# EAGLE design eib-128 (EAGLE 8.3.2)
DESIGNER: JON NEWMAN; DESIGN_NAME: EIB-128; LICENSE: CERN OHL v1.2; REVISION: 1.1
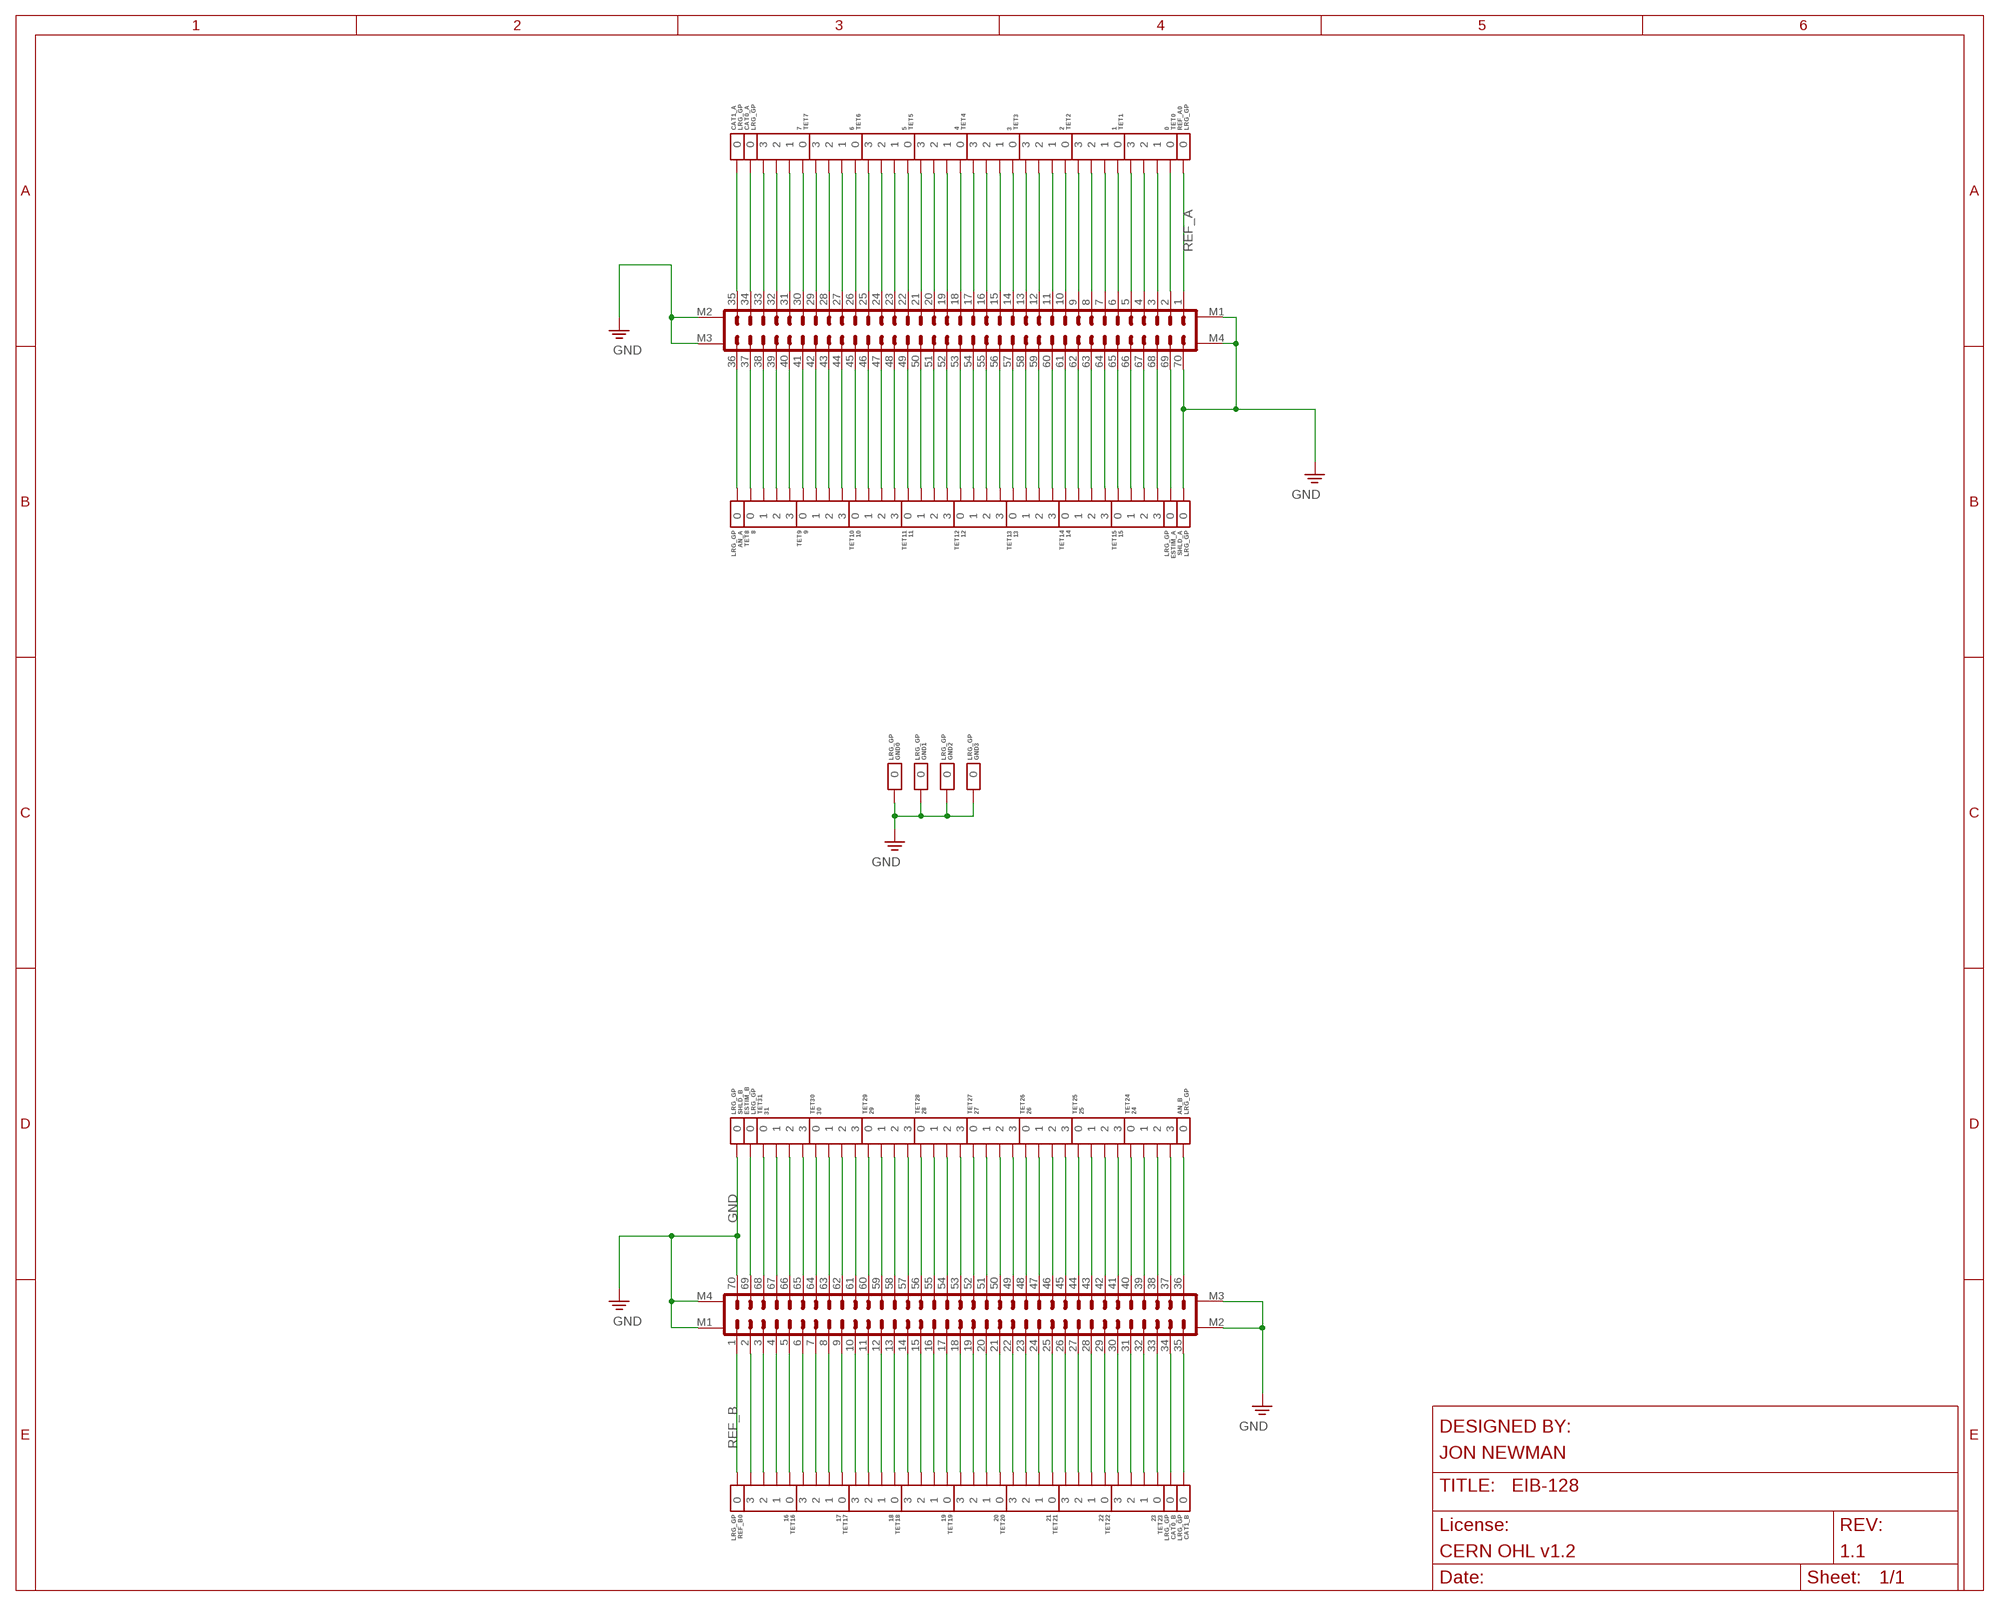
[diagram p0: schematic, sheet 1]

## Parts
A  DF40HEAD  PINHD-2X35+4_DF40-70HEAD  [DF40-70HEAD]
AN_A  LRG_GP  GOLDPIN_0.5ID_0.7OD  [GOLDPIN_0.5ID_0.7OD]
AN_B  LRG_GP  GOLDPIN_0.5ID_0.7OD  [GOLDPIN_0.5ID_0.7OD]
B  DF40HEAD  PINHD-2X35+4_DF40-70HEAD  [DF40-70HEAD]
CAT0_A  LRG_GP  GOLDPIN_0.5ID_0.7OD  [GOLDPIN_0.5ID_0.7OD]
CAT0_B  LRG_GP  GOLDPIN_0.5ID_0.7OD  [GOLDPIN_0.5ID_0.7OD]
CAT1_A  LRG_GP  GOLDPIN_0.5ID_0.7OD  [GOLDPIN_0.5ID_0.7OD]
CAT1_B  LRG_GP  GOLDPIN_0.5ID_0.7OD  [GOLDPIN_0.5ID_0.7OD]
ESTIM_A  LRG_GP  GOLDPIN_0.5ID_0.7OD  [GOLDPIN_0.5ID_0.7OD]
ESTIM_B  LRG_GP  GOLDPIN_0.5ID_0.7OD  [GOLDPIN_0.5ID_0.7OD]
GND0  LRG_GP  GOLDPIN_0.5ID_0.7OD  [GOLDPIN_0.5ID_0.7OD]
GND1  LRG_GP  GOLDPIN_0.5ID_0.7OD  [GOLDPIN_0.5ID_0.7OD]
GND2  LRG_GP  GOLDPIN_0.5ID_0.7OD  [GOLDPIN_0.5ID_0.7OD]
GND3  LRG_GP  GOLDPIN_0.5ID_0.7OD  [GOLDPIN_0.5ID_0.7OD]
REF_A0  LRG_GP  GOLDPIN_0.5ID_0.7OD  [GOLDPIN_0.5ID_0.7OD]
REF_B0  LRG_GP  GOLDPIN_0.5ID_0.7OD  [GOLDPIN_0.5ID_0.7OD]
SHLD_A  LRG_GP  GOLDPIN_0.5ID_0.7OD  [GOLDPIN_0.5ID_0.7OD]
SHLD_B  LRG_GP  GOLDPIN_0.5ID_0.7OD  [GOLDPIN_0.5ID_0.7OD]
TET0  0  TETRODE_128_0.5ID_0.7OD  [TETRODE_128_0.5ID_0.7OD]
TET1  1  TETRODE_128_0.5ID_0.7OD  [TETRODE_128_0.5ID_0.7OD]
TET2  2  TETRODE_128_0.5ID_0.7OD  [TETRODE_128_0.5ID_0.7OD]
TET3  3  TETRODE_128_0.5ID_0.7OD  [TETRODE_128_0.5ID_0.7OD]
TET4  4  TETRODE_128_0.5ID_0.7OD  [TETRODE_128_0.5ID_0.7OD]
TET5  5  TETRODE_128_0.5ID_0.7OD  [TETRODE_128_0.5ID_0.7OD]
TET6  6  TETRODE_128_0.5ID_0.7OD  [TETRODE_128_0.5ID_0.7OD]
TET7  7  TETRODE_128_0.5ID_0.7OD  [TETRODE_128_0.5ID_0.7OD]
TET8  8  TETRODE_128_0.5ID_0.7OD  [TETRODE_128_0.5ID_0.7OD]
TET9  9  TETRODE_128_0.5ID_0.7OD  [TETRODE_128_0.5ID_0.7OD]
TET10  10  TETRODE_128_0.5ID_0.7OD  [TETRODE_128_0.5ID_0.7OD]
TET11  11  TETRODE_128_0.5ID_0.7OD  [TETRODE_128_0.5ID_0.7OD]
TET12  12  TETRODE_128_0.5ID_0.7OD  [TETRODE_128_0.5ID_0.7OD]
TET13  13  TETRODE_128_0.5ID_0.7OD  [TETRODE_128_0.5ID_0.7OD]
TET14  14  TETRODE_128_0.5ID_0.7OD  [TETRODE_128_0.5ID_0.7OD]
TET15  15  TETRODE_128_0.5ID_0.7OD  [TETRODE_128_0.5ID_0.7OD]
TET16  16  TETRODE_128_0.5ID_0.7OD  [TETRODE_128_0.5ID_0.7OD]
TET17  17  TETRODE_128_0.5ID_0.7OD  [TETRODE_128_0.5ID_0.7OD]
TET18  18  TETRODE_128_0.5ID_0.7OD  [TETRODE_128_0.5ID_0.7OD]
TET19  19  TETRODE_128_0.5ID_0.7OD  [TETRODE_128_0.5ID_0.7OD]
TET20  20  TETRODE_128_0.5ID_0.7OD  [TETRODE_128_0.5ID_0.7OD]
TET21  21  TETRODE_128_0.5ID_0.7OD  [TETRODE_128_0.5ID_0.7OD]
TET22  22  TETRODE_128_0.5ID_0.7OD  [TETRODE_128_0.5ID_0.7OD]
TET23  23  TETRODE_128_0.5ID_0.7OD  [TETRODE_128_0.5ID_0.7OD]
TET24  24  TETRODE_128_0.5ID_0.7OD  [TETRODE_128_0.5ID_0.7OD]
TET25  25  TETRODE_128_0.5ID_0.7OD  [TETRODE_128_0.5ID_0.7OD]
TET26  26  TETRODE_128_0.5ID_0.7OD  [TETRODE_128_0.5ID_0.7OD]
TET27  27  TETRODE_128_0.5ID_0.7OD  [TETRODE_128_0.5ID_0.7OD]
TET28  28  TETRODE_128_0.5ID_0.7OD  [TETRODE_128_0.5ID_0.7OD]
TET29  29  TETRODE_128_0.5ID_0.7OD  [TETRODE_128_0.5ID_0.7OD]
TET30  30  TETRODE_128_0.5ID_0.7OD  [TETRODE_128_0.5ID_0.7OD]
TET31  31  TETRODE_128_0.5ID_0.7OD  [TETRODE_128_0.5ID_0.7OD]

## Nets
AN_A: A.36 AN_A.P$1
AN_B: AN_B.P$1 B.36
CAT0_A: A.34 CAT0_A.P$1
CAT0_B: B.34 CAT0_B.P$1
CAT1_A: A.35 CAT1_A.P$1
CAT1_B: B.35 CAT1_B.P$1
ESTIM_A: A.69 ESTIM_A.P$1
ESTIM_B: B.69 ESTIM_B.P$1
GND: A.70 A.M1 A.M2 A.M3 A.M4 B.70 B.M1 B.M2 B.M3 B.M4 GND0.P$1 GND1.P$1 GND2.P$1 GND3.P$1 SHLD_A.P$1 SHLD_B.P$1
N$65: B.33 TET23.0
N$66: B.32 TET23.1
N$67: B.31 TET23.2
N$68: B.30 TET23.3
N$69: B.29 TET22.0
N$70: B.28 TET22.1
N$71: B.27 TET22.2
N$72: B.26 TET22.3
N$73: B.25 TET21.0
N$74: B.24 TET21.1
N$75: B.23 TET21.2
N$76: B.22 TET21.3
N$77: B.21 TET20.0
N$78: B.20 TET20.1
N$79: B.19 TET20.2
N$80: B.18 TET20.3
N$81: B.17 TET19.0
N$82: B.16 TET19.1
N$83: B.15 TET19.2
N$84: B.14 TET19.3
N$85: B.13 TET18.0
N$86: B.12 TET18.1
N$87: B.11 TET18.2
N$88: B.10 TET18.3
N$89: B.9 TET17.0
N$90: B.8 TET17.1
N$91: B.7 TET17.2
N$92: B.6 TET17.3
N$93: B.5 TET16.0
N$94: B.4 TET16.1
N$95: B.3 TET16.2
N$96: B.38 TET24.2
N$97: B.39 TET24.1
N$98: B.40 TET24.0
N$99: B.41 TET25.3
N$100: B.42 TET25.2
N$101: B.43 TET25.1
N$102: B.44 TET25.0
N$103: B.45 TET26.3
N$104: B.46 TET26.2
N$105: B.47 TET26.1
N$106: B.48 TET26.0
N$107: B.49 TET27.3
N$108: B.50 TET27.2
N$109: B.51 TET27.1
N$110: B.52 TET27.0
N$111: B.53 TET28.3
N$112: B.54 TET28.2
N$113: B.55 TET28.1
N$114: B.56 TET28.0
N$115: B.57 TET29.3
N$116: B.58 TET29.2
N$117: B.59 TET29.1
N$118: B.60 TET29.0
N$119: B.61 TET30.3
N$120: B.62 TET30.2
N$121: B.63 TET30.1
N$122: B.64 TET30.0
N$123: B.65 TET31.3
N$124: B.66 TET31.2
N$125: B.67 TET31.1
N$126: B.68 TET31.0
N$127: B.2 TET16.3
N$128: B.37 TET24.3
N$199: A.33 TET7.3
N$200: A.32 TET7.2
N$201: A.31 TET7.1
N$202: A.30 TET7.0
N$203: A.29 TET6.3
N$204: A.28 TET6.2
N$205: A.27 TET6.1
N$206: A.26 TET6.0
N$207: A.25 TET5.3
N$208: A.24 TET5.2
N$209: A.23 TET5.1
N$210: A.22 TET5.0
N$211: A.21 TET4.3
N$212: A.20 TET4.2
N$213: A.19 TET4.1
N$214: A.18 TET4.0
N$215: A.17 TET3.3
N$216: A.16 TET3.2
N$217: A.15 TET3.1
N$218: A.14 TET3.0
N$219: A.13 TET2.3
N$220: A.12 TET2.2
N$221: A.11 TET2.1
N$222: A.10 TET2.0
N$223: A.9 TET1.3
N$224: A.8 TET1.2
N$225: A.7 TET1.1
N$226: A.6 TET1.0
N$227: A.5 TET0.3
N$228: A.4 TET0.2
N$229: A.3 TET0.1
N$230: A.2 TET0.0
N$231: A.38 TET8.1
N$232: A.39 TET8.2
N$233: A.40 TET8.3
N$234: A.41 TET9.0
N$235: A.42 TET9.1
N$236: A.43 TET9.2
N$237: A.44 TET9.3
N$238: A.45 TET10.0
N$239: A.46 TET10.1
N$240: A.47 TET10.2
N$241: A.48 TET10.3
N$242: A.49 TET11.0
N$243: A.50 TET11.1
N$244: A.51 TET11.2
N$245: A.52 TET11.3
N$246: A.53 TET12.0
N$247: A.54 TET12.1
N$248: A.55 TET12.2
N$249: A.56 TET12.3
N$250: A.57 TET13.0
N$251: A.58 TET13.1
N$252: A.59 TET13.2
N$253: A.60 TET13.3
N$254: A.61 TET14.0
N$255: A.62 TET14.1
N$256: A.63 TET14.2
N$257: A.64 TET14.3
N$258: A.65 TET15.0
N$259: A.66 TET15.1
N$260: A.67 TET15.2
N$261: A.68 TET15.3
N$1000: A.37 TET8.0
REF_A: A.1 REF_A0.P$1
REF_B: B.1 REF_B0.P$1

## Library data of the parts
A B = jonnew:PINHD-2X35+4
AN_A AN_B CAT0_A CAT0_B CAT1_A CAT1_B ESTIM_A ESTIM_B GND0 GND1-GND3 REF_A0 REF_B0 SHLD_A SHLD_B = jonnew:GOLDPIN
TET0 TET1-TET31 = jonnew:TETRODE

## Net classes
1 thick: width 0.102 mm

## Board
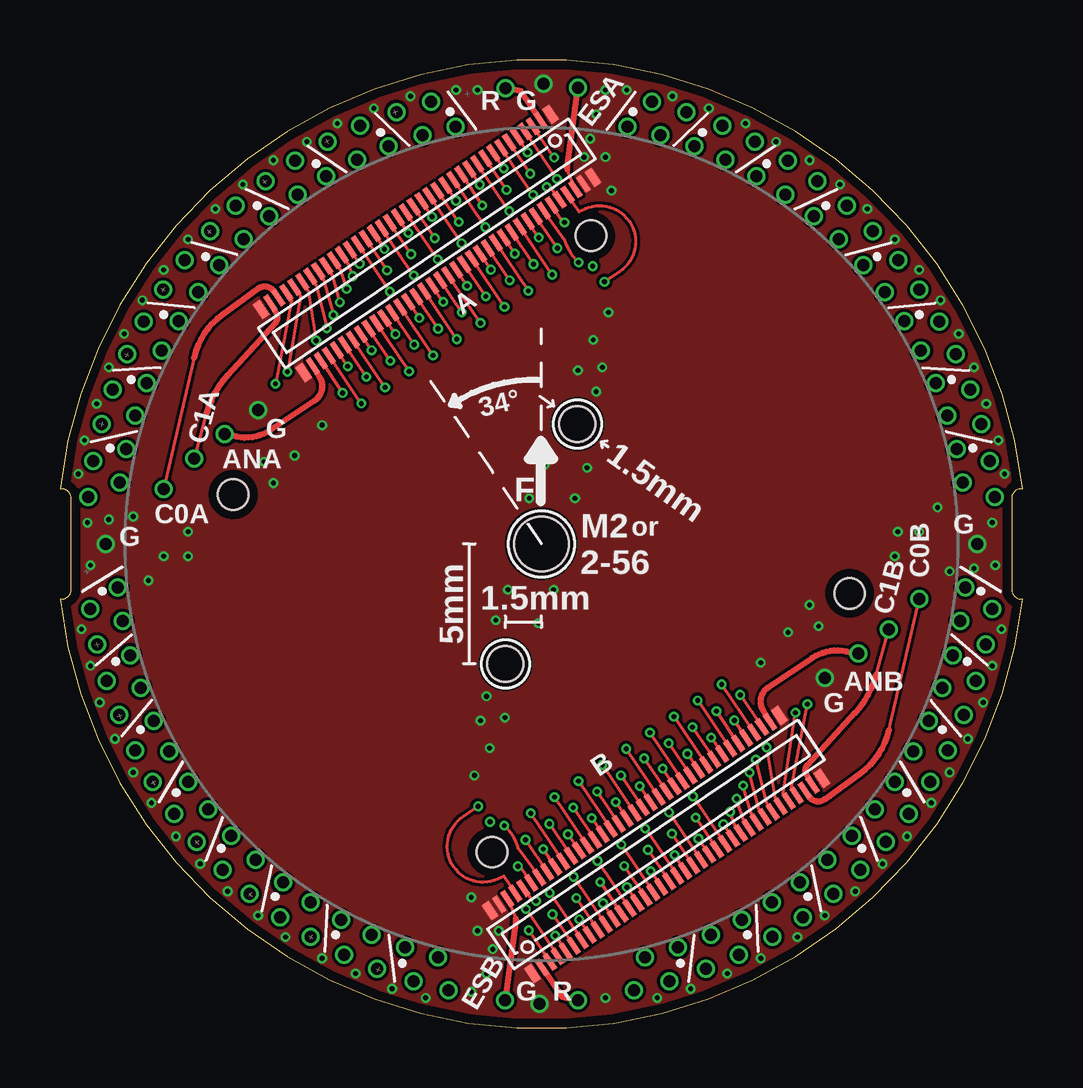
[diagram p1: board, top side]
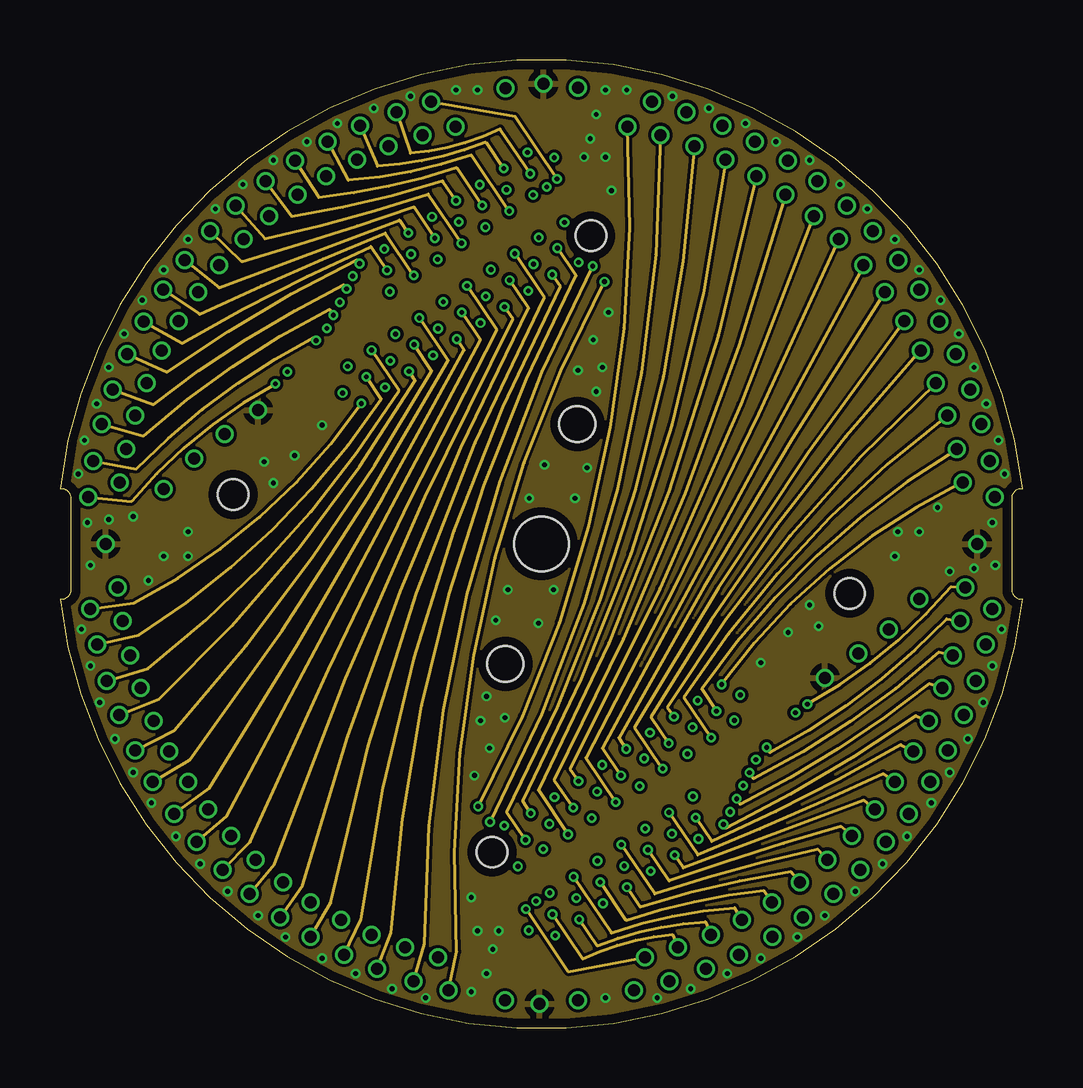
[diagram p2: board, inner layer Route2]
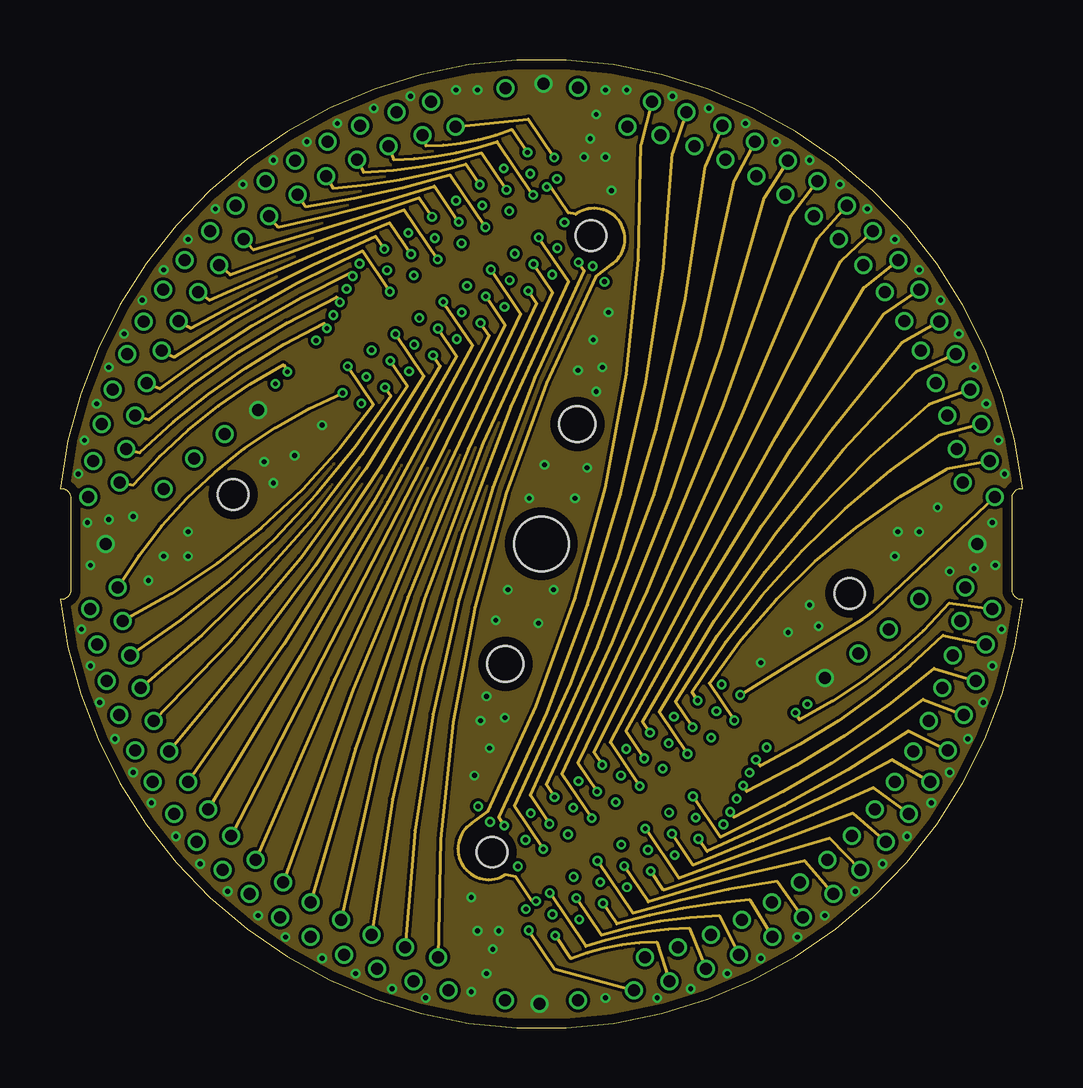
[diagram p3: board, inner layer Route15]
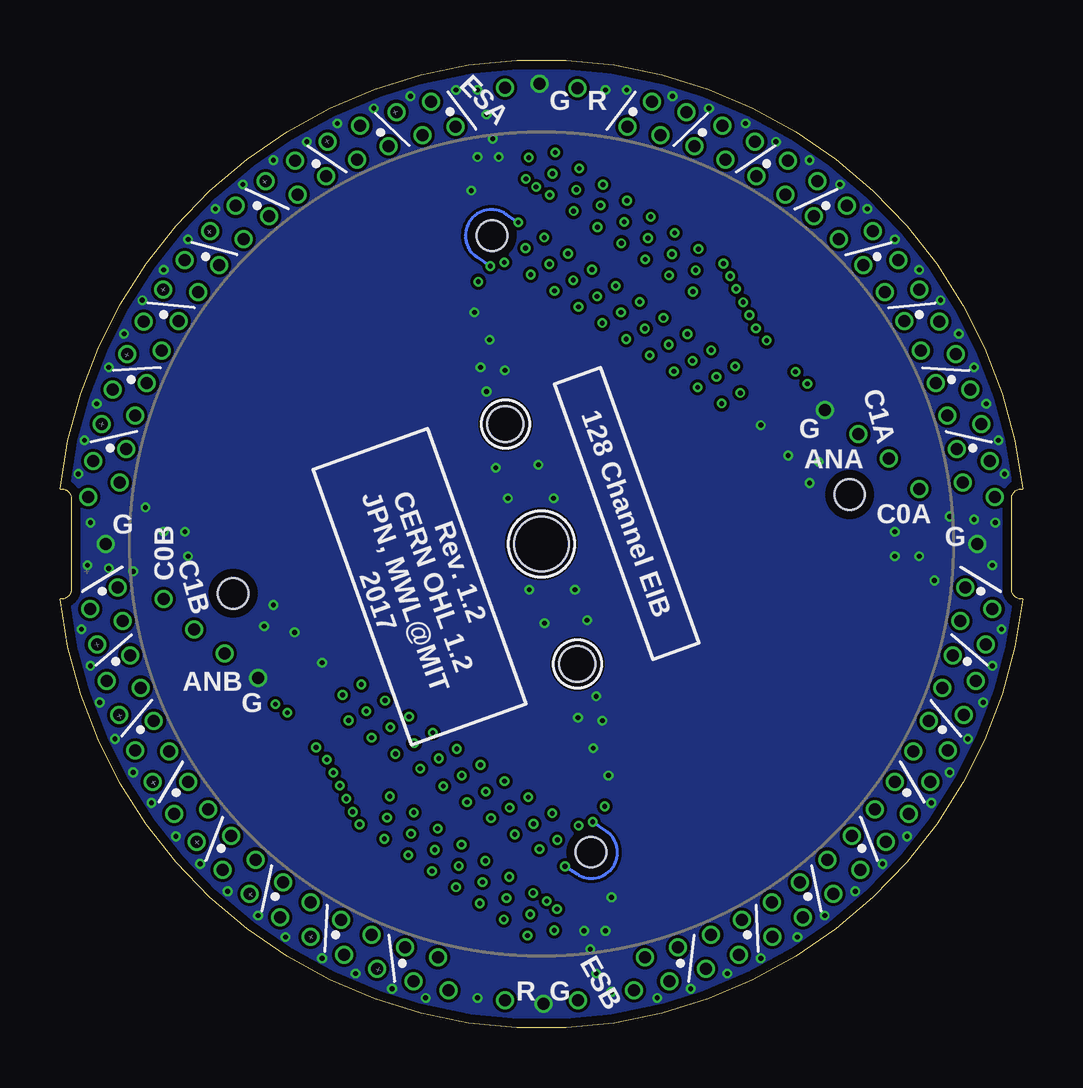
[diagram p4: board, bottom side, seen from below]

Size 40.14 x 40.35 mm. Coordinates in mm from the lower left corner, seen from the top.
Outline: 0,17.88 0.07,17.88 arc90 0.47,18.28 0.47,22.08 arc90 0.07,22.48 0,22.48 arc-167 40.14,22.48 40.07,22.48 arc90 39.67,22.08 39.67,18.28 arc90 40.07,17.88 40.14,17.88 arc-167 0,17.88
Copper layers (1*2*15*16): Top 0.035559375mm / dielectric 0.17018125mm / Route2 0.01778125mm / dielectric 47mil / Route15 0.01778125mm / dielectric 0.17018125mm / Bottom 0.035559375mm
Design rules "sierra-circuits-advanced *": minimum track width 5mil, minimum drill 0.000196875mm, track to track 5mil, track to pad 5mil, pad to pad 5mil, via to via 5mil, smd to smd 5mil, copper to edge 15mil, drill to drill 5mil, minimum pad ring 4mil, minimum via ring 4mil, stop-mask expansion 4mil, vias tented up to drill 100mil, thermal gap 10mil
Holes 1.27 mm at 22.13,33.02 32.92,18.12 18.01,7.33 7.22,22.23
tKeepout: area 0.2,0.3 to 39.9,40.1

### Footprints (pad centres in the part's own frame; a part is rotated, then mirrored left to right if it is on the bottom)
DF40-70HEAD = smd 0.23 x 0.75: 1 -6.8,-1.585; 2 -6.4,-1.585; 3 -6,-1.585; 4 -5.6,-1.585; 5 -5.2,-1.585; 6 -4.8,-1.585; 7 -4.4,-1.585; 8 -4,-1.585; 9 -3.6,-1.585; 10 -3.2,-1.585; 11 -2.8,-1.585; 12 -2.4,-1.585; 13 -2,-1.585; 14 -1.6,-1.585; 15 -1.2,-1.585; 16 -0.8,-1.585; 17 -0.4,-1.585; 18 0,-1.585; 19 0.4,-1.585; 20 0.8,-1.585; 21 1.2,-1.585; 22 1.6,-1.585; 23 2,-1.585; 24 2.4,-1.585; 25 2.8,-1.585; 26 3.2,-1.585; 27 3.6,-1.585; 28 4,-1.585; 29 4.4,-1.585; 30 4.8,-1.585; 31 5.2,-1.585; 32 5.6,-1.585; 33 6,-1.585; 34 6.4,-1.585; 35 6.8,-1.585; 36 6.8,1.585; 37 6.4,1.585; 38 6,1.585; 39 5.6,1.585; 40 5.2,1.585; 41 4.8,1.585; 42 4.4,1.585; 43 4,1.585; 44 3.6,1.585; 45 3.2,1.585; 46 2.8,1.585; 47 2.4,1.585; 48 2,1.585; 49 1.6,1.585; 50 1.2,1.585; 51 0.8,1.585; 52 0.4,1.585; 53 0,1.585; 54 -0.4,1.585; 55 -0.8,1.585; 56 -1.2,1.585; 57 -1.6,1.585; 58 -2,1.585; 59 -2.4,1.585; 60 -2.8,1.585; 61 -3.2,1.585; 62 -3.6,1.585; 63 -4,1.585; 64 -4.4,1.585; 65 -4.8,1.585; 66 -5.2,1.585; 67 -5.6,1.585; 68 -6,1.585; 69 -6.4,1.585; 70 -6.8,1.585 | smd 0.35 x 0.75: M1 -7.275,-1.585; M2 7.275,-1.585; M3 7.275,1.585; M4 -7.275,1.585
GOLDPIN_0.5ID_0.7OD = drill 0.5 pad 0.7: P$1 0,0
TETRODE_128_0.5ID_0.7OD = drill 0.5 pad 0.703: 0 0.724,17.743; 1 1.562,18.934; 2 2.14,17.628; 3 3.058,18.748
EIB_MOUNT_A = hole 2.261: 0,0 | hole 1.5: 1.5,5; -1.5,-5

### Placement (x,y rotation side)
A  15.3,32.7 214 top
AN_A  6.86,24.75 0 top
AN_B  33.28,15.6 0 top
B  24.84,7.65 34 top
CAT0_A  4.32,22.46 0 top
CAT0_B  35.82,17.89 0 top
CAT1_A  5.59,23.73 0 top
CAT1_B  34.55,16.62 0 top
ESTIM_A  21.59,39.2 0 top
ESTIM_B  18.55,1.15 0 top
GND0  19.99,1 0 top
GND1  1.91,20.18 0 top
GND2  8.26,25.76 0 top
GND3  38.23,20.18 0 top
REF_A0  18.57,39.18 0 top
REF_B0  21.59,1.15 34 top
SHLD_A  31.88,14.59 0 top
SHLD_B  20.15,39.35 0 top
TET0  20.07,20.18 350.7 bottom
TET1  20.07,20.18 341.3 bottom
TET2  20.07,20.18 332 bottom
TET3  20.07,20.18 322.6 bottom
TET4  20.07,20.18 313.2 bottom
TET5  20.07,20.18 303.9 bottom
TET6  20.07,20.18 294.5 bottom
TET7  20.07,20.18 285.2 bottom
TET8  20.07,20.18 266.5 bottom
TET9  20.07,20.18 257.2 bottom
TET10  20.07,20.18 247.8 bottom
TET11  20.07,20.18 238.4 bottom
TET12  20.07,20.18 229.1 bottom
TET13  20.07,20.18 219.7 bottom
TET14  20.07,20.18 210.4 bottom
TET15  20.07,20.18 201 bottom
TET16  20.07,20.18 201 top
TET17  20.07,20.18 210.4 top
TET18  20.07,20.18 219.7 top
TET19  20.07,20.18 229.1 top
TET20  20.07,20.18 238.4 top
TET21  20.07,20.18 247.8 top
TET22  20.07,20.18 257.2 top
TET23  20.07,20.18 266.5 top
TET24  20.07,20.18 285.2 top
TET25  20.07,20.18 294.5 top
TET26  20.07,20.18 303.9 top
TET27  20.07,20.18 313.2 top
TET28  20.07,20.18 322.6 top
TET29  20.07,20.18 332 top
TET30  20.07,20.18 341.3 top
TET31  20.07,20.18 350.7 top
U$1  [EIB_MOUNT_A]  20.07,20.18 0 top

### Tracks (layer width: path | path; a pad name or v marks a point on that pad's centre or on a via)
AN_A
  Top 0.254: A.36 10.82,27.12 arc-87 10.6,26.14 8.78,24.92 arc-45 7.37,24.65 AN_A.P$1
AN_B
  Top 0.254: B.36 29.32,13.23 arc-87 29.54,14.21 31.36,15.43 arc-45 32.77,15.71 AN_B.P$1
CAT0_A
  Top 0.127: A.34 8.91,30.71 | 5.59,27.94 CAT0_A.P$1
  Top 0.254: 8.91,30.71 arc91 8.25,30.82 6.78,29.74 arc41 5.59,27.94
CAT0_B
  Top 0.127: B.34 31.23,9.64 | 34.55,12.41 CAT0_B.P$1
  Top 0.254: 31.23,9.64 arc91 31.88,9.53 33.36,10.61 arc41 34.55,12.41
CAT1_A
  Top 0.127: 6.1,25.61 CAT1_A.P$1
  Top 0.254: 6.1,25.61 arc-27 7,27.23 8.99,29.4 arc73 9.03,29.78 A.35
CAT1_B
  Top 0.127: 34.04,14.74 CAT1_B.P$1
  Top 0.254: 34.04,14.74 arc-27 33.14,13.13 31.15,10.95 arc73 31.11,10.57 B.35
ESTIM_A
  Top 0.127: A.69 21.14,35.8
  Top 0.254: 21.14,35.8 ESTIM_A.P$1 21.14,35.8
ESTIM_B
  Top 0.127: B.69 19,4.55
  Top 0.254: 19,4.55 ESTIM_B.P$1 19,4.55
GND  (via drill 0.2)
  other vias: 1.15,21.06 1.27,19.29 3.05,21.32 3.69,18.65 5.34,19.67 5.34,20.68 9.78,23.86 8.51,23.6 8.89,22.72 10.93,25.13 22.1,37.07 22.74,36.3 22.99,34.91 21.85,36.3 16.51,39.1 22.86,29.83 22.23,28.68 22.61,27.54 21.59,27.41 22.36,26.53 21.97,23.35 20.2,23.48 21.47,22.08 19.56,22.08 22.36,38.08 2.04,21.19 17.4,39.1 4.32,19.67 38.99,19.29 38.87,21.06 37.09,19.03 36.58,21.7 34.93,20.68 34.8,19.67 30.36,16.49 31.63,16.75 31.25,17.64 29.21,15.22 17.15,1.51 18.04,3.28 17.4,4.05 17.15,5.44 18.29,4.05 17.28,10.52 17.91,11.67 17.53,12.81 18.55,12.94 17.78,13.83 18.16,17 19.94,16.87 18.67,18.27 20.58,18.27 17.78,2.27 38.1,19.16 22.74,1.25 35.82,20.68 0.77,23.1 1.02,24.49 1.53,26.02 2.04,27.54 2.67,28.94 3.43,30.34 4.32,31.61 5.34,32.88 6.48,34.15 7.62,35.16 8.89,36.18 10.29,36.94 11.56,37.7 13.08,38.34 14.61,38.84 0.89,16.62 1.27,15.1 1.65,13.57 2.29,12.05 3.05,10.65 3.81,9.38 4.83,7.98 5.85,6.84 6.99,5.7 8.26,4.68 9.4,3.79 10.93,2.9 12.32,2.27 13.85,1.63 15.24,1.25 23.63,39.1 22.74,39.1 39.37,23.1 39.12,24.49 38.61,26.02 38.1,27.54 37.47,28.94 36.71,30.34 35.82,31.61 34.8,32.88 33.66,34.15 32.52,35.16 31.25,36.18 29.85,36.94 28.58,37.7 27.05,38.34 25.53,38.84 39.25,16.62 38.87,15.1 38.48,13.57 37.85,12.05 37.09,10.65 36.33,9.38 35.31,7.98 34.29,6.84 33.15,5.7 31.88,4.68 30.74,3.79 29.21,2.9 27.82,2.27 26.29,1.63 24.9,1.25
  pour Top (no thermals): -15.49,-15.38 -15.49,55.74 58.17,55.74 58.17,-15.38
  pour Bottom (no thermals): -7.87,-7.76 -7.87,48.12 50.55,48.12 50.55,-7.76
  pour Route15 (no thermals): -10.41,-10.3 -10.41,50.66 53.09,50.66 53.09,-10.3
  pour Route2: -12.95,-12.84 55.63,-12.84 55.63,53.2 -12.95,53.2
N$65  (via drill 0.2 pad 0.3)
  Top 0.127: B.33 30.48,10.02 v31.16,13.5
  Route2 0.127: v31.16,13.5 arc21 37.15,18.4 TET23.0
N$66  (via drill 0.2 pad 0.3)
  Top 0.127: B.32 30.14,9.81 30.15,9.82 v30.66,13.14
  Route15 0.127: TET23.1 37.08,17.71 arc-21 30.82,12.84 v30.66,13.14
N$67  (via drill 0.2)
  Top 0.127: B.31 29.81,9.59 v29.46,11.69
  Route2 0.127: TET23.2 36.96,17.05 arc-18 29.61,11.48 29.6,11.48 v29.46,11.69
N$68  (via drill 0.2)
  Top 0.127: B.30 29.48,9.36 v29.01,11.18
  Route15 0.127: TET23.3 36.81,16.37 arc-18 29.19,10.92 29.19,10.93 v29.01,11.18
N$69  (via drill 0.2)
  Top 0.127: B.29 29.14,9.14 v28.74,10.64
  Route2 0.127: TET22.0 36.64,15.67 arc-15 28.91,10.39 28.91,10.4 v28.74,10.64
N$70  (via drill 0.2)
  Top 0.127: B.28 29.06,8.58 28.82,8.92 v28.48,10.1
  Route15 0.127: TET22.1 36.43,14.99 arc-15 28.63,9.86 v28.48,10.1
N$71  (via drill 0.2)
  Top 0.127: B.27 28.49,8.7 v28.21,9.55
  Route2 0.127: TET22.2 36.24,14.36 arc-12 28.37,9.32 28.36,9.32 v28.21,9.55
N$72  (via drill 0.2)
  Top 0.127: B.26 28.36,8.11 28.13,8.45 v27.94,9.01
  Route15 0.127: TET22.3 35.97,13.7 arc-12 28.09,8.79 28.09,8.78 v27.94,9.01
N$73  (via drill 0.2)
  Top 0.127: B.25 v27.65,8.49
  Route2 0.127: v27.65,8.49 27.76,8.33 27.76,8.33 arc9 35.68,13.01 TET21.0
N$74  (via drill 0.2)
  Top 0.127: B.24 v26.39,9.65
  Route15 0.127: v26.39,9.65 27.54,7.95 arc9 35.39,12.38 TET21.1
N$75  (via drill 0.2)
  Top 0.127: B.23 v26.5,8.77
  Route2 0.127: v26.5,8.77 27.18,7.77 arc6 35.06,11.81 TET21.2
N$76  (via drill 0.2)
  Top 0.127: B.22 v26.62,7.88
  Route15 0.127: v26.62,7.88 26.97,7.35 arc6 34.7,11.18 TET21.3
N$77  (via drill 0.2)
  Top 0.127: B.21 v25.39,8.98
  Route2 0.127: v25.39,8.98 26.59,7.21 arc3 34.32,10.6 TET20.0
N$78  (via drill 0.2)
  Top 0.127: B.20 v25.51,8.09
  Route15 0.127: v25.51,8.09 B.20 arc3 33.91,10.02 TET20.1
N$79  (via drill 0.2)
  Top 0.127: B.19 v25.62,7.21
  Route2 0.127: v25.62,7.21 25.99,6.67 33.51,9.49 TET20.2
N$80  (via drill 0.2)
  Top 0.127: B.18 v24.4,8.31
  Route15 0.127: v24.4,8.31 25.79,6.24 33.05,8.95 TET20.3
N$81  (via drill 0.2)
  Top 0.127: B.17 v24.51,7.42
  Route2 0.127: v24.51,7.42 25.39,6.12 arc-3 32.57,8.4 TET19.0
N$82  (via drill 0.2)
  Top 0.127: B.16 v24.63,6.54
  Route15 0.127: v24.63,6.54 25.16,5.74 arc-3 32.08,7.91 TET19.1
N$83  (via drill 0.2)
  Top 0.127: B.15 v23.4,7.64
  Route2 0.127: v23.4,7.64 24.79,5.58 arc-6 31.59,7.45 TET19.2
N$84  (via drill 0.2)
  Top 0.127: B.14 v23.52,6.75
  Route15 0.127: v23.52,6.75 24.53,5.25 arc-6 31.04,6.97 TET19.3
N$85  (via drill 0.2)
  Top 0.127: B.13 v23.63,5.87
  Route2 0.127: v23.63,5.87 24.18,5.05 arc-9 30.46,6.52 TET18.0
N$86  (via drill 0.2)
  Top 0.127: B.12 v22.41,6.97
  Route15 0.127: v22.41,6.97 23.88,4.78 arc-9 29.9,6.1 TET18.1
N$87  (via drill 0.2)
  Top 0.127: B.11 v22.52,6.08
  Route2 0.127: v22.52,6.08 23.59,4.5 arc-12 29.34,5.74 TET18.2
N$88  (via drill 0.2)
  Top 0.127: B.10 v22.64,5.19
  Route15 0.127: v22.64,5.19 23.22,4.33 arc-12 28.76,5.34 TET18.3
N$89  (via drill 0.2)
  Top 0.127: B.9 v21.41,6.3
  Route2 0.127: v21.41,6.3 22.99,3.96 arc-15 28.12,5.02 TET17.0
N$90  (via drill 0.2)
  Top 0.127: B.8 v21.53,5.41
  Route15 0.127: v21.53,5.41 22.57,3.87 arc-15 27.49,4.68 TET17.1
N$91  (via drill 0.2)
  Top 0.127: B.7 v21.64,4.52
  Route2 0.127: v21.64,4.52 22.38,3.43 arc-18 26.9,4.43 TET17.2
N$92  (via drill 0.2)
  Top 0.127: B.6 v20.42,5.63
  Route15 0.127: v20.42,5.63 21.92,3.4 arc-18 26.24,4.15 TET17.3
N$93  (via drill 0.2)
  Top 0.127: B.5 v20.53,4.74
  Route2 0.127: v20.53,4.74 21.79,2.88 arc-21 25.53,3.89 TET16.0
N$94  (via drill 0.2)
  Top 0.127: B.4 v20.65,3.85
  Route15 0.127: v20.65,3.85 21.3,2.89 arc-21 24.88,3.58 TET16.1
N$95  (via drill 0.2)
  Top 0.127: B.3 v19.42,4.96
  Route2 0.127: v19.42,4.96 21.18,2.35 TET16.2
N$96  (via drill 0.2)
  Top 0.127: B.38 v27.58,14.32
  Route2 0.127: v27.58,14.32 arc-28 37.63,22.75 TET24.2
N$97  (via drill 0.2)
  Top 0.127: B.39 | B.39 v28.11,12.82
  Route15 0.127: 28.14,12.77 arc90 28.14,12.77 v28.11,12.82 27.07,14.36 arc-28 36.96,23.3 TET24.1
N$98  (via drill 0.2)
  Top 0.127: B.40 v27.36,13.21
  Route2 0.127: v27.36,13.21 26.75,14.13 arc-24 37.38,24.11 TET24.0
N$99  (via drill 0.2)
  Top 0.127: B.41 v26.59,13.65
  Route15 0.127: v26.59,13.65 arc-90 v26.58,13.65 26.34,14 arc-24 36.63,24.7 TET25.3
N$100  (via drill 0.2)
  Top 0.127: B.42 v27.15,12.1
  Route2 0.127: v27.15,12.1 26.01,13.77 arc-20 36.98,25.53 TET25.2
N$101  (via drill 0.2)
  Top 0.127: B.43 v26.37,12.54
  Route15 0.127: v26.37,12.54 arc90 v26.37,12.54 25.66,13.6 arc-20 36.22,25.98 TET25.1
N$102  (via drill 0.2)
  Top 0.127: B.44 v25.59,12.98
  Route2 0.127: v25.59,12.98 25.33,13.37 arc-16 36.52,26.89 TET25.0
N$103  (via drill 0.2)
  Top 0.127: B.45 v26.15,11.43
  Route15 0.127: TET26.3 35.68,27.33 arc16 24.99,13.18 24.99,13.16 v26.15,11.43
N$104  (via drill 0.2)
  Top 0.127: B.46 v25.38,11.87
  Route2 0.127: v25.38,11.87 24.64,12.96 arc-12 35.86,28.24 TET26.2
N$105  (via drill 0.2)
  Top 0.127: B.47 v24.6,12.31
  Route15 0.127: v24.6,12.31 arc-90 v24.59,12.31 24.29,12.76 arc-12 35.07,28.55 TET26.1
N$106  (via drill 0.2)
  Top 0.127: B.48 v25.12,10.81
  Route2 0.127: 25.16,10.76 v25.12,10.81 23.96,12.53 arc-8 35.2,29.46 TET26.0
N$107  (via drill 0.2)
  Top 0.127: B.49 v24.35,11.24
  Route15 0.127: 24.38,11.2 arc90 24.38,11.2 | 24.38,11.2 v24.35,11.24 23.6,12.35 arc-8 34.32,29.76 TET27.3
N$108  (via drill 0.2)
  Top 0.127: B.50 v23.6,11.63
  Route2 0.127: v23.6,11.63 23.3,12.1 arc-4 34.38,30.67 TET27.2
N$109  (via drill 0.2)
  Top 0.127: B.51 v24.16,10.08
  Route15 0.127: v24.16,10.08 arc-90 v24.16,10.09 22.94,11.9 arc-4 33.51,30.86 TET27.1
N$110  (via drill 0.2)
  Top 0.127: B.52 v23.39,10.52
  Route2 0.127: v23.39,10.52 22.61,11.67 TET27.0
N$111  (via drill 0.2)
  Top 0.127: B.53 v22.61,10.96
  Route15 0.127: v22.61,10.96 arc90 v22.61,10.97 22.25,11.49 32.55,31.97 TET28.3
N$112  (via drill 0.2)
  Top 0.127: B.54 v23.17,9.41
  Route2 0.127: v23.17,9.41 21.92,11.26 arc4 32.47,32.89 TET28.2
N$113  (via drill 0.2)
  Top 0.127: B.55 v22.39,9.85
  Route15 0.127: v22.39,9.85 arc-90 v22.39,9.85 21.59,11.03 arc4 31.58,32.9 TET28.1
N$114  (via drill 0.2)
  Top 0.127: B.56 v21.61,10.29
  Route2 0.127: v21.61,10.29 21.26,10.8 arc8 31.4,33.84 TET28.0
N$115  (via drill 0.2)
  Top 0.127: B.57 v22.17,8.74
  Route15 0.127: v22.17,8.74 arc-90 v22.17,8.74 20.93,10.57 arc8 30.46,33.84 TET29.3
N$116  (via drill 0.2)
  Top 0.127: B.58 v21.4,9.18
  Route2 0.127: v21.4,9.18 20.6,10.35 arc12 30.24,34.72 TET29.2
N$117  (via drill 0.2)
  Top 0.127: B.59 v20.62,9.62
  Route15 0.127: v20.62,9.62 arc90 v20.62,9.63 20.27,10.14 arc12 29.35,34.62 TET29.1
N$118  (via drill 0.2)
  Top 0.127: B.60 v21.18,8.07
  Route2 0.127: v21.18,8.07 19.94,9.91 arc16 TET29.0
N$119  (via drill 0.2)
  Top 0.127: B.61 v20.4,8.51
  Route15 0.127: v20.4,8.51 arc90 v20.4,8.52 19.61,9.69 arc16 28.12,35.35 TET30.3
N$120  (via drill 0.2)
  Top 0.127: B.62 v19.62,8.95
  Route2 0.127: v19.62,8.95 19.28,9.46 arc20 27.77,36.19 TET30.2
N$121  (via drill 0.2)
  Top 0.127: B.63 v20.15,7.45
  Route15 0.127: 20.18,7.4 v20.15,7.45 18.95,9.23 arc20 26.9,35.94 TET30.1
N$122  (via drill 0.2)
  Top 0.127: B.64 v19.41,7.84
  Route2 0.127: v19.41,7.84 18.62,9 arc24 26.45,36.76 TET30.0
N$123  (via drill 0.2 pad 0.3)
  Top 0.127: B.65 19.92,6.36 19.12,7.46 arc30 v18.52,8.44
  Route15 0.127: v18.52,8.44 arc-90 v18.52,8.44 18.29,8.77 arc24 25.54,36.46 TET31.3
N$124  (via drill 0.2 pad 0.3)
  Top 0.127: 19.58,6.14 B.66 19.2,6.72 v19.09,6.74
  Route2 0.127: TET31.2 25.04,37.2 arc-28 v17.93,8.6 v17.93,8.59
  Bottom 0.127: v19.09,6.74 18.59,6.42 arc-180 17.38,8.22 v17.93,8.59
N$125  (via drill 0.2 pad 0.3)
  Top 0.127: 19.27,5.92 B.67 19.28,5.91 19.67,5.32 v19.85,5.29
  Route15 0.127: 19.67,5.32 v19.85,5.29 19.65,5.33 18.99,6.32 18.58,6.39 arc-180 17.17,8.54 17.84,9.03 arc28 24.22,36.82 TET31.1
N$126  (via drill 0.2 pad 0.3)
  Top 0.127: B.68 18.49,6.33 18.5,6.34 arc-180 16.79,8.81 v17.43,9.23
  Route2 0.127: v17.43,9.23 arc32 TET31.0
N$127  (via drill 0.2)
  Top 0.127: B.2 v19.54,4.07
  Route15 0.127: v19.54,4.07 20.62,2.46 TET16.3
N$128  (via drill 0.2)
  Top 0.127: B.37 v28.36,13.88
  Route15 0.127: TET24.3 34.06,17.51 arc-11 33.47,17.06 v28.36,13.88
N$199  (via drill 0.2 pad 0.3)
  Top 0.127: A.33 9.66,30.33 v8.98,26.85
  Route2 0.127: TET7.3 2.99,21.95 arc-21 v8.98,26.85
N$200  (via drill 0.2 pad 0.3)
  Top 0.127: A.32 10.02,30.53 v9.48,27.35
  Route15 0.127: TET7.2 3.06,22.64 arc-21 9.32,27.65 | 9.32,27.65 v9.48,27.35 | 9.32,27.65
N$201  (via drill 0.2)
  Top 0.127: A.31 10.34,30.74 v10.68,28.66
  Route2 0.127: TET7.1 3.18,23.3 arc-18 10.58,28.79 v10.68,28.66
N$202  (via drill 0.2)
  Top 0.127: A.30 10.68,30.97 v11.13,29.17
  Route15 0.127: TET7.0 3.33,23.99 arc-18 11.02,29.38 11.13,29.22 11.15,29.18 v11.13,29.17
N$203  (via drill 0.2)
  Top 0.127: A.29 10.99,31.18 v11.4,29.71
  Route2 0.127: TET6.3 3.5,24.68 arc-15 11.23,29.96 v11.4,29.71 v11.39,29.71 v11.4,29.72 11.27,29.9
N$204  (via drill 0.2)
  Top 0.127: A.28 11.34,31.39 v11.66,30.25
  Route15 0.127: TET6.2 3.71,25.36 arc-15 11.52,30.47 v11.67,30.25 v11.66,30.25
N$205  (via drill 0.2)
  Top 0.127: A.27 11.68,31.61 v11.95,30.81
  Route2 0.127: TET6.1 3.9,25.99 arc-12 11.83,30.98 v11.95,30.81 11.93,30.8
N$206  (via drill 0.2)
  Top 0.127: A.26 12.02,31.84 v12.2,31.34
  Route15 0.127: TET6.0 4.17,26.65 arc-12 12.12,31.49 12.22,31.35 v12.2,31.34
N$207  (via drill 0.2)
  Top 0.127: A.25 v12.49,31.86
  Route2 0.127: TET5.3 4.46,27.34 arc-9 12.38,32.03 12.38,32.02 v12.49,31.86
N$208  (via drill 0.2)
  Top 0.127: A.24 v13.75,30.7
  Route15 0.127: TET5.2 4.75,27.97 arc-9 12.6,32.4 v13.75,30.7
N$209  (via drill 0.2)
  Top 0.127: A.23 v13.64,31.59
  Route2 0.127: TET5.1 5.08,28.54 arc-6 12.96,32.58 v13.64,31.59
N$210  (via drill 0.2)
  Top 0.127: A.22 v13.52,32.47
  Route15 0.127: TET5.0 5.44,29.17 arc-6 13.17,33 v13.52,32.47
N$211  (via drill 0.2)
  Top 0.127: A.21 v14.75,31.37
  Route2 0.127: TET4.3 5.82,29.75 arc-3 13.55,33.14 v14.75,31.37
N$212  (via drill 0.2)
  Top 0.127: A.20 v14.63,32.26
  Route15 0.127: TET4.2 6.23,30.34 arc-3 A.20 v14.63,32.26
N$213  (via drill 0.2)
  Top 0.127: A.19 v14.52,33.14
  Route2 0.127: TET4.1 6.63,30.86 14.15,33.68 v14.52,33.14
N$214  (via drill 0.2)
  Top 0.127: A.18 v15.74,32.04
  Route15 0.127: TET4.0 7.09,31.4 14.35,34.11 v15.74,32.04
N$215  (via drill 0.2)
  Top 0.127: A.17 v15.63,32.93
  Route2 0.127: TET3.3 7.57,31.95 arc3 14.75,34.23 v15.63,32.93
N$216  (via drill 0.2)
  Top 0.127: A.16 v15.51,33.81
  Route15 0.127: TET3.2 8.06,32.44 arc3 14.97,34.61 v15.51,33.81
N$217  (via drill 0.2)
  Top 0.127: A.15 v16.74,32.71
  Route2 0.127: TET3.1 8.55,32.9 arc6 15.35,34.77 v16.74,32.71
N$218  (via drill 0.2)
  Top 0.127: A.14 v16.62,33.6
  Route15 0.127: TET3.0 9.1,33.38 arc6 15.61,35.1 v16.62,33.6
N$219  (via drill 0.2)
  Top 0.127: A.13 v16.51,34.49
  Route2 0.127: v16.51,34.49 15.95,35.3 arc-9 9.68,33.83 TET2.3
N$220  (via drill 0.2)
  Top 0.127: A.12 v17.73,33.38
  Route15 0.127: TET2.2 10.24,34.25 arc9 16.26,35.57 v17.73,33.38
N$221  (via drill 0.2)
  Top 0.127: A.11 v17.6,34.29
  Route2 0.127: 17.62,34.27 v17.6,34.29 16.55,35.86 arc-12 10.8,34.62 TET2.1
N$222  (via drill 0.2)
  Top 0.127: A.10 v17.5,35.16
  Route15 0.127: TET2.0 11.38,35.01 arc12 16.92,36.02 v17.5,35.16
N$223  (via drill 0.2)
  Top 0.127: A.9 v18.73,34.05
  Route2 0.127: v18.73,34.05 17.15,36.39 arc-15 12.02,35.33 TET1.3
N$224  (via drill 0.2)
  Top 0.127: A.8 v18.61,34.94
  Route15 0.127: v18.61,34.94 17.57,36.48 arc-15 12.65,35.67 TET1.2
N$225  (via drill 0.2)
  Top 0.127: A.7 v18.5,35.83
  Route2 0.127: v18.5,35.83 17.76,36.92 arc-18 13.24,35.92 TET1.1
N$226  (via drill 0.2)
  Top 0.127: A.6 v19.72,34.72
  Route15 0.127: v19.72,34.72 18.22,36.95 arc-18 13.9,36.2 TET1.0
N$227  (via drill 0.2)
  Top 0.127: A.5 v19.61,35.61
  Route2 0.127: v19.61,35.61 18.35,37.47 arc-21 14.61,36.46 TET0.3
N$228  (via drill 0.2)
  Top 0.127: A.4 v19.49,36.5
  Route15 0.127: v19.49,36.5 18.84,37.46 arc-21 15.25,36.77 TET0.2
N$229  (via drill 0.2)
  Top 0.127: A.3 v20.72,35.4
  Route2 0.127: v20.72,35.4 18.96,38 TET0.1
N$230  (via drill 0.2)
  Top 0.127: A.2 v20.6,36.28
  Route15 0.127: TET0.0 19.52,37.89 v20.6,36.28
N$231  (via drill 0.2)
  Top 0.127: A.38 v12.56,26.03
  Route2 0.127: TET8.1 3.08,17.71 arc28 v12.56,26.03
N$232  (via drill 0.2)
  Top 0.127: A.39 | A.39 v12,27.58
  Route15 0.127: TET8.2 arc28 13.07,25.99 v12,27.58 arc-90 v12,27.58
N$233  (via drill 0.2)
  Top 0.127: A.40 v12.77,27.14
  Route2 0.127: TET8.3 3.31,16.39 arc24 13.39,26.22 v12.77,27.14
N$234  (via drill 0.2)
  Top 0.127: A.41 v13.55,26.7
  Route15 0.127: TET9.0 arc24 13.8,26.35 v13.56,26.7 arc90 v13.55,26.7
N$235  (via drill 0.2)
  Top 0.127: A.42 v12.99,28.25
  Route2 0.127: TET9.1 3.69,14.99 arc20 14.13,26.58 v12.99,28.25
N$236  (via drill 0.2)
  Top 0.127: A.43 v13.77,27.81
  Route15 0.127: TET9.2 arc20 14.48,26.75 v13.77,27.81 arc-90 v13.77,27.81
N$237  (via drill 0.2)
  Top 0.127: A.44 v14.55,27.37
  Route2 0.127: TET9.3 4.14,13.72 arc16 14.81,26.98 v14.55,27.37
N$238  (via drill 0.2)
  Top 0.127: A.45 v13.98,28.92
  Route15 0.127: TET10.0 arc16 15.17,27.19 15.16,27.19 v13.98,28.92
N$239  (via drill 0.2)
  Top 0.127: A.46 v14.76,28.48
  Route2 0.127: TET10.1 4.75,12.4 arc12 15.5,27.39 v14.76,28.48
N$240  (via drill 0.2)
  Top 0.127: A.47 v15.55,28.04
  Route15 0.127: TET10.2 arc12 15.85,27.59 v15.55,28.04 v15.55,28.04 arc90 v15.54,28.05
N$241  (via drill 0.2)
  Top 0.127: A.48 v14.98,29.6
  Route2 0.127: TET10.3 5.41,11.18 arc8 16.18,27.82 v14.98,29.6
N$242  (via drill 0.2)
  Top 0.127: A.49 v15.76,29.16
  Route15 0.127: TET11.0 arc8 16.54,28 v15.76,29.16 | v15.76,29.16 arc90 v15.76,29.16
N$243  (via drill 0.2)
  Top 0.127: A.50 v16.54,28.72
  Route2 0.127: TET11.1 6.23,9.99 arc4 16.84,28.25 v16.54,28.72
N$244  (via drill 0.2)
  Top 0.127: A.51 v15.97,30.27
  Route15 0.127: TET11.2 arc4 17.2,28.46 v15.98,30.27 arc90 v15.97,30.27
N$245  (via drill 0.2)
  Top 0.127: A.52 v16.75,29.83
  Route2 0.127: TET11.3 6.94,8.82 17.53,28.68 v16.75,29.83
N$246  (via drill 0.2)
  Top 0.127: A.53 v17.53,29.39
  Route15 0.127: TET12.0 17.89,28.86 v17.53,29.39 arc-90 v17.53,29.39
N$247  (via drill 0.2)
  Top 0.127: A.54 v16.97,30.94
  Route2 0.127: TET12.1 7.93,7.75 arc-4 18.22,29.09 v16.97,30.94
N$248  (via drill 0.2)
  Top 0.127: A.55 v17.75,30.5
  Route15 0.127: TET12.2 arc-4 18.55,29.32 v17.75,30.5 arc90 v17.75,30.5
N$249  (via drill 0.2)
  Top 0.127: A.56 v18.53,30.06
  Route2 0.127: TET12.3 8.94,6.84 arc-8 18.88,29.55 v18.53,30.06
N$250  (via drill 0.2)
  Top 0.127: A.57 v17.96,31.61
  Route15 0.127: TET13.0 arc-8 19.21,29.78 17.97,31.61 arc90 v17.96,31.61
N$251  (via drill 0.2)
  Top 0.127: A.58 v18.74,31.17
  Route2 0.127: TET13.1 10.11,5.95 arc-12 19.54,30.01 v18.74,31.17
N$252  (via drill 0.2)
  Top 0.127: A.59 v19.52,30.73
  Route15 0.127: TET13.2 arc-12 19.87,30.21 v19.52,30.72 arc-90 v19.52,30.73
N$253  (via drill 0.2)
  Top 0.127: A.60 v18.96,32.28
  Route2 0.127: TET13.3 11.28,5.21 arc-16 20.2,30.44 v18.96,32.28
N$254  (via drill 0.2)
  Top 0.127: A.61 v19.74,31.84
  Route15 0.127: TET14.0 arc-16 20.53,30.67 v19.74,31.84 arc-90 v19.74,31.84
N$255  (via drill 0.2)
  Top 0.127: A.62 v20.52,31.4
  Route2 0.127: TET14.1 12.55,4.53 arc-20 20.86,30.89 v20.52,31.4
N$256  (via drill 0.2)
  Top 0.127: A.63 v19.95,32.95
  Route15 0.127: TET14.2 arc-20 21.19,31.12 v19.95,32.95
N$257  (via drill 0.2)
  Top 0.127: A.64 v20.73,32.51
  Route2 0.127: TET14.3 13.8,3.97 arc-24 21.52,31.35 v20.73,32.51
N$258  (via drill 0.2 pad 0.3)
  Top 0.127: A.65 20.22,33.99 21.02,32.88 arc30 v21.62,31.91
  Route15 0.127: TET15.0 arc-24 21.85,31.58 v21.62,31.91 arc90 v21.62,31.91
N$259  (via drill 0.2, 0.2 pad 0.3)
  Top 0.127: A.66 20.97,33.59 v21.03,33.58
  Route2 0.127: TET15.1 15.19,3.51 arc-28 v22.21,31.76
  Bottom 0.127: v21.03,33.58 21.54,33.93 arc-180 22.76,32.13 v22.21,31.76
N$260  (via drill 0.2 pad 0.3)
  Top 0.127: 20.87,34.43 A.67 20.86,34.44 20.47,35.03 v20.29,35.06
  Route15 0.127: TET15.2 arc-28 22.34,31.34 22.97,31.81 arc180 21.56,33.96 21.5,33.92 21.18,33.98 20.47,35.03 v20.29,35.06 20.47,35.03
N$261  (via drill 0.2 pad 0.3)
  Top 0.127: A.68 21.65,34.02 21.64,34.01 arc-180 23.35,31.54 v22.7,31.11
  Route2 0.127: TET15.3 16.54,3.18 arc-32 v22.7,31.11
N$1000  (via drill 0.2)
  Top 0.127: A.37 v11.78,26.47
  Route15 0.127: TET8.0 arc-36 v11.78,26.47
REF_A
  Top 0.254: A.1 19.22,39.05 REF_A0.P$1
REF_B
  Top 0.254: B.1 20.92,1.3 REF_B0.P$1

### Text on the board
tPlace: ESA | R | G | C1A | G | 34° | ANA | C0A | G | G | C0B | C1B | ANB | G | ESB | G | R
bPlace: ESA | R | G | C1A | G | ANA | C0A | 128 Channel EIB | G | G | C0B | Rev. 1.2 / CERN OHL 1.2 / JPN, MWL@MIT / 2017 | C1B | ANB | G | ESB | G | R